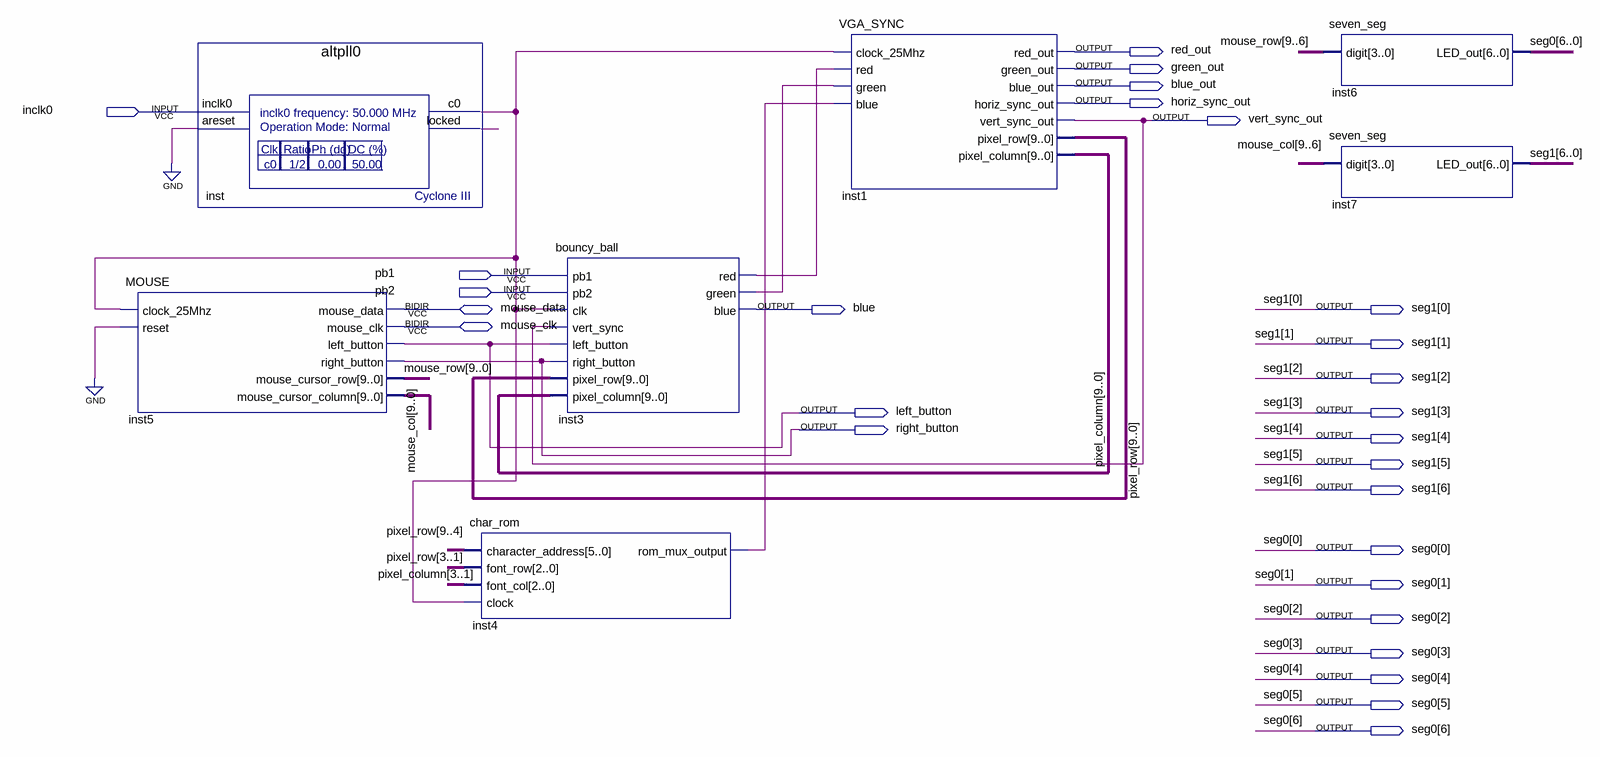
[diagram p0: schematic sheet]
// Quartus schematic Ball_movement.bdf as structural Verilog: 7 symbols, 27 pins
module Ball_movement (
  input  inclk0,
  input  pb1,
  input  pb2,
  inout  mouse_data,
  inout  mouse_clk,
  output red_out,
  output green_out,
  output blue_out,
  output horiz_sync_out,
  output vert_sync_out,
  output blue,
  output [6:0] seg1,
  output left_button,
  output right_button,
  output [6:0] seg0
);

  wire inst3_green, inst3_red, inst4_rom_mux_output, inst_c0, inst_locked;
  wire [9:0] mouse_col, mouse_row, pixel_column, pixel_row;

  MOUSE inst5 (
    .clock_25Mhz(inst_c0), .reset(1'b0), .left_button(left_button), .right_button(right_button),
    .mouse_cursor_row(mouse_row), .mouse_cursor_column(mouse_col), .mouse_data(mouse_data),
    .mouse_clk(mouse_clk));
  altpll0 inst (.inclk0(inclk0), .areset(1'b0), .c0(inst_c0), .locked(inst_locked));
  char_rom inst4 (
    .character_address(pixel_row[9:4]), .font_row(pixel_row[3:1]), .font_col(pixel_column[3:1]),
    .clock(inst_c0), .rom_mux_output(inst4_rom_mux_output));
  bouncy_ball inst3 (
    .pb1(pb1), .pb2(pb2), .clk(inst_c0), .vert_sync(vert_sync_out), .left_button(left_button),
    .right_button(right_button), .pixel_row(pixel_row), .pixel_column(pixel_column), .red(inst3_red),
    .green(inst3_green), .blue(blue));
  VGA_SYNC inst1 (
    .clock_25Mhz(inst_c0), .red(inst3_red), .green(inst3_green), .blue(inst4_rom_mux_output),
    .red_out(red_out), .green_out(green_out), .blue_out(blue_out), .horiz_sync_out(horiz_sync_out),
    .vert_sync_out(vert_sync_out), .pixel_row(pixel_row), .pixel_column(pixel_column));
  seven_seg inst6 (.digit(mouse_row[9:6]), .LED_out(seg0));
  seven_seg inst7 (.digit(mouse_col[9:6]), .LED_out(seg1));
endmodule
